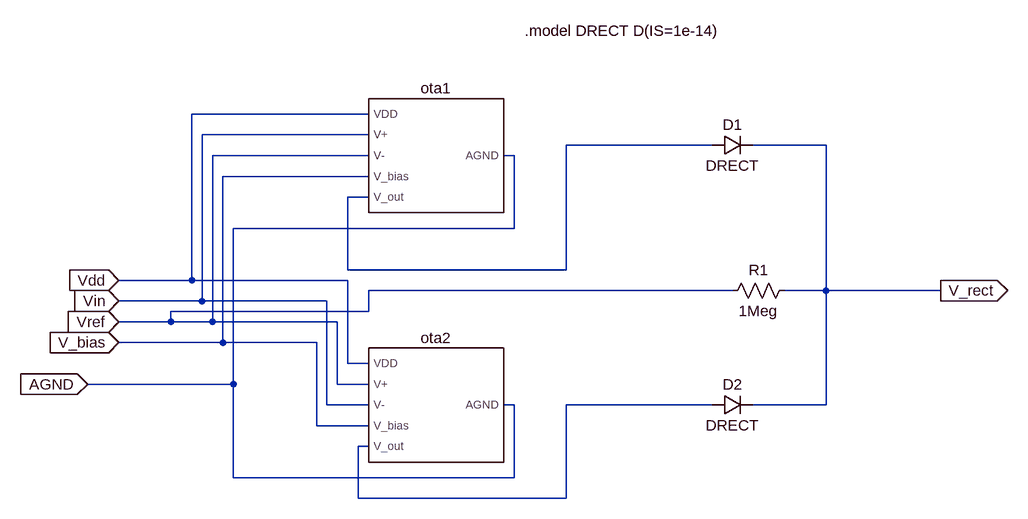
[diagram p0: schematic precision_fullwave.asc]
precision_fullwave.asc, the LTspice schematic file:
Version 4.1
SHEET 1 1128 680
WIRE 112 32 -160 32
WIRE 112 64 -144 64
WIRE 640 80 416 80
WIRE 816 80 704 80
WIRE 112 96 -128 96
WIRE 336 96 320 96
WIRE 112 128 -112 128
WIRE 112 160 80 160
WIRE 336 208 336 96
WIRE 336 208 -96 208
WIRE 80 272 80 160
WIRE 416 272 416 80
WIRE 416 272 80 272
WIRE -160 288 -160 32
WIRE -160 288 -272 288
WIRE 80 288 -160 288
WIRE 672 304 112 304
WIRE 816 304 816 80
WIRE 816 304 752 304
WIRE 992 304 816 304
WIRE -144 320 -144 64
WIRE -144 320 -272 320
WIRE 48 320 -144 320
WIRE 112 336 112 304
WIRE 112 336 -192 336
WIRE -192 352 -192 336
WIRE -192 352 -272 352
WIRE -128 352 -128 96
WIRE -128 352 -192 352
WIRE 64 352 -128 352
WIRE -112 384 -112 128
WIRE -112 384 -272 384
WIRE 32 384 -112 384
WIRE 80 416 80 288
WIRE 112 416 80 416
WIRE -96 448 -96 208
WIRE -96 448 -320 448
WIRE 64 448 64 352
WIRE 112 448 64 448
WIRE 48 480 48 320
WIRE 112 480 48 480
WIRE 336 480 320 480
WIRE 640 480 416 480
WIRE 816 480 816 304
WIRE 816 480 704 480
WIRE 32 512 32 384
WIRE 112 512 32 512
WIRE 112 544 96 544
WIRE -96 592 -96 448
WIRE 336 592 336 480
WIRE 336 592 -96 592
WIRE 96 624 96 544
WIRE 416 624 416 480
WIRE 416 624 96 624
FLAG -272 288 Vdd
IOPIN -272 288 In
FLAG -272 320 Vin
IOPIN -272 320 In
FLAG -272 352 Vref
IOPIN -272 352 In
FLAG -272 384 V_bias
IOPIN -272 384 In
FLAG 992 304 V_rect
IOPIN 992 304 Out
FLAG -320 448 AGND
IOPIN -320 448 In
SYMBOL ota_core 208 96 R0
SYMATTR InstName ota1
SYMBOL ota_core 208 480 R0
SYMATTR InstName ota2
SYMBOL diode 640 96 R270
WINDOW 0 32 32 VTop 2
WINDOW 3 0 32 VBottom 2
SYMATTR InstName D1
SYMATTR Value DRECT
SYMBOL diode 640 496 R270
WINDOW 0 32 32 VTop 2
WINDOW 3 0 32 VBottom 2
SYMATTR InstName D2
SYMATTR Value DRECT
SYMBOL res 768 288 R90
WINDOW 0 0 56 VBottom 2
WINDOW 3 32 56 VTop 2
SYMATTR InstName R1
SYMATTR Value 1Meg
TEXT 352 -96 Left 2 !.model DRECT D(IS=1e-14)

The netlist it stands for:
* precision_fullwave.asc
X§ota1 Vdd Vin Vref V_bias N001 AGND ota_core  ; pins VDD V+ V- V_bias V_out AGND
X§ota2 Vdd Vref Vin V_bias N002 AGND ota_core  ; pins VDD V+ V- V_bias V_out AGND
D1 N001 V_rect DRECT
D2 N002 V_rect DRECT
R1 V_rect Vref 1Meg
.model D D
.lib standard.dio
.model DRECT D(IS=1e-14)
.backanno
.end